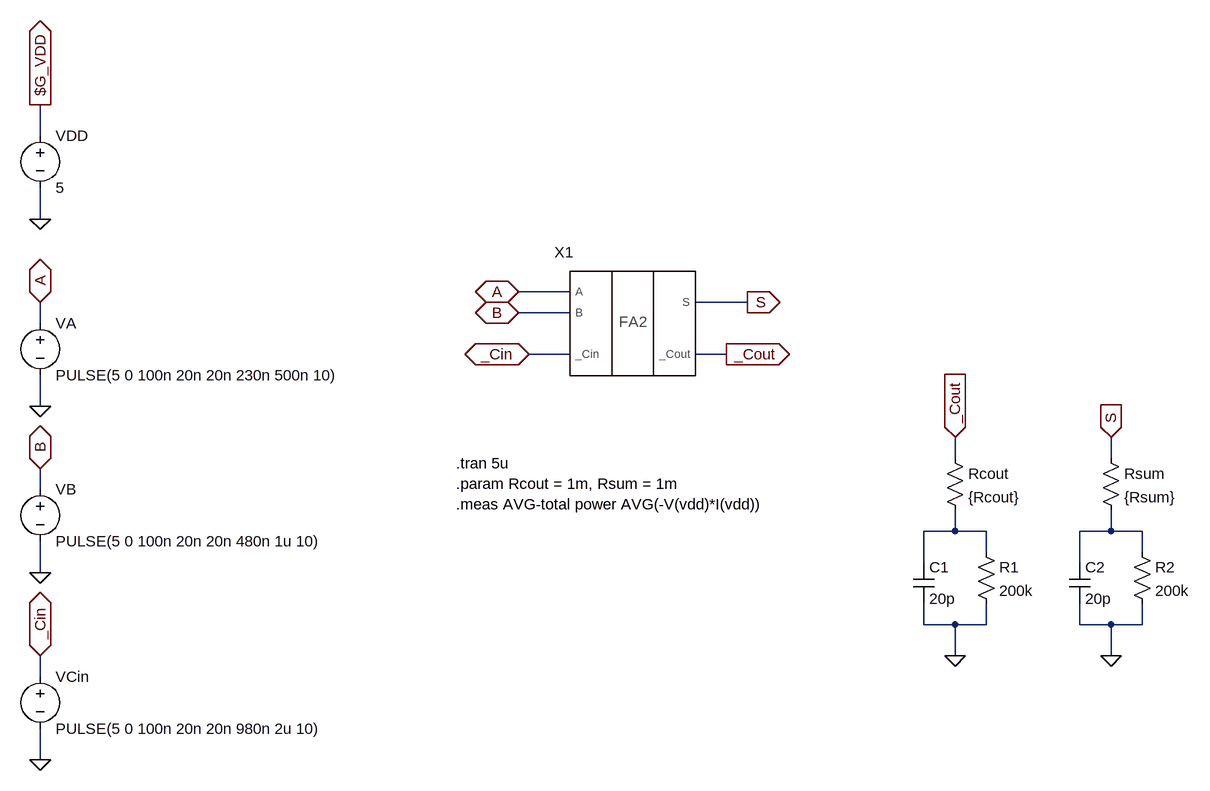
[diagram p0: schematic fa2_top[pulse].asc]
fa2_top[pulse].asc, the LTspice schematic file:
Version 4
SHEET 1 2652 1172
WIRE -640 112 -640 64
WIRE -640 240 -640 192
WIRE 176 352 96 352
WIRE 448 368 368 368
WIRE 176 384 96 384
WIRE -640 400 -640 368
WIRE 176 448 112 448
WIRE 416 448 368 448
WIRE -640 528 -640 480
WIRE 768 608 768 576
WIRE 1008 608 1008 576
WIRE -640 656 -640 624
WIRE 768 720 768 688
WIRE 768 720 720 720
WIRE 816 720 768 720
WIRE 1008 720 1008 688
WIRE 1008 720 960 720
WIRE 1056 720 1008 720
WIRE 816 752 816 720
WIRE 1056 752 1056 720
WIRE 720 768 720 720
WIRE 960 768 960 720
WIRE -640 784 -640 736
WIRE 720 864 720 832
WIRE 768 864 720 864
WIRE 816 864 816 832
WIRE 816 864 768 864
WIRE 960 864 960 832
WIRE 1008 864 960 864
WIRE 1056 864 1056 832
WIRE 1056 864 1008 864
WIRE 768 912 768 864
WIRE 1008 912 1008 864
WIRE -640 944 -640 912
WIRE -640 1072 -640 1024
FLAG -640 240 0
FLAG -640 64 $G_VDD
IOPIN -640 64 Out
FLAG -640 624 B
IOPIN -640 624 BiDir
FLAG -640 784 0
FLAG -640 368 A
IOPIN -640 368 BiDir
FLAG -640 528 0
FLAG -640 912 _Cin
IOPIN -640 912 BiDir
FLAG -640 1072 0
FLAG 768 576 _Cout
IOPIN 768 576 In
FLAG 768 912 0
FLAG 1008 576 S
IOPIN 1008 576 In
FLAG 1008 912 0
FLAG 448 368 S
IOPIN 448 368 Out
FLAG 416 448 _Cout
IOPIN 416 448 Out
FLAG 96 352 A
IOPIN 96 352 BiDir
FLAG 96 384 B
IOPIN 96 384 BiDir
FLAG 112 448 _Cin
IOPIN 112 448 BiDir
SYMBOL voltage -640 96 R0
WINDOW 123 0 0 Left 2
WINDOW 39 0 0 Left 2
SYMATTR InstName VDD
SYMATTR Value 5
SYMBOL voltage -640 640 R0
WINDOW 123 0 0 Left 2
WINDOW 39 0 0 Left 2
SYMATTR InstName VB
SYMATTR Value PULSE(5 0 100n 20n 20n 480n 1u 10)
SYMBOL voltage -640 384 R0
WINDOW 123 0 0 Left 2
WINDOW 39 0 0 Left 2
SYMATTR InstName VA
SYMATTR Value PULSE(5 0 100n 20n 20n 230n 500n 10)
SYMBOL voltage -640 928 R0
WINDOW 123 0 0 Left 2
WINDOW 39 0 0 Left 2
SYMATTR InstName VCin
SYMATTR Value PULSE(5 0 100n 20n 20n 980n 2u 10)
SYMBOL cap 704 768 R0
SYMATTR InstName C1
SYMATTR Value 20p
SYMBOL res 800 736 R0
SYMATTR InstName R1
SYMATTR Value 200k
SYMBOL res 752 592 R0
SYMATTR InstName Rcout
SYMATTR Value {Rcout}
SYMBOL cap 944 768 R0
SYMATTR InstName C2
SYMATTR Value 20p
SYMBOL res 1040 736 R0
SYMATTR InstName R2
SYMATTR Value 200k
SYMBOL res 992 592 R0
SYMATTR InstName Rsum
SYMATTR Value {Rsum}
SYMBOL fa2 272 400 R0
SYMATTR InstName X1
TEXT 0 616 Left 2 !.tran 5u\n.param Rcout = 1m, Rsum = 1m\n.meas AVG-total power AVG(-V(vdd)*I(vdd))

The netlist it stands for:
* fa2_top[pulse].asc
VDD $G_VDD 0 5
VB B 0 PULSE(5 0 100n 20n 20n 480n 1u 10)
VA A 0 PULSE(5 0 100n 20n 20n 230n 500n 10)
VCin _Cin 0 PULSE(5 0 100n 20n 20n 980n 2u 10)
C1 N001 0 20p
R1 N001 0 200k
Rcout _Cout N001 {Rcout}
C2 N002 0 20p
R2 N002 0 200k
Rsum S N002 {Rsum}
XX1 A B _Cin S _Cout fa2  ; pins A B _Cin S _Cout
.tran 5u
.param Rcout = 1m, Rsum = 1m
.meas AVG-total power AVG(-V(vdd)*I(vdd))
.backanno
.end